# EAGLE schematic Instruction_memory (EAGLE 9.4.2)
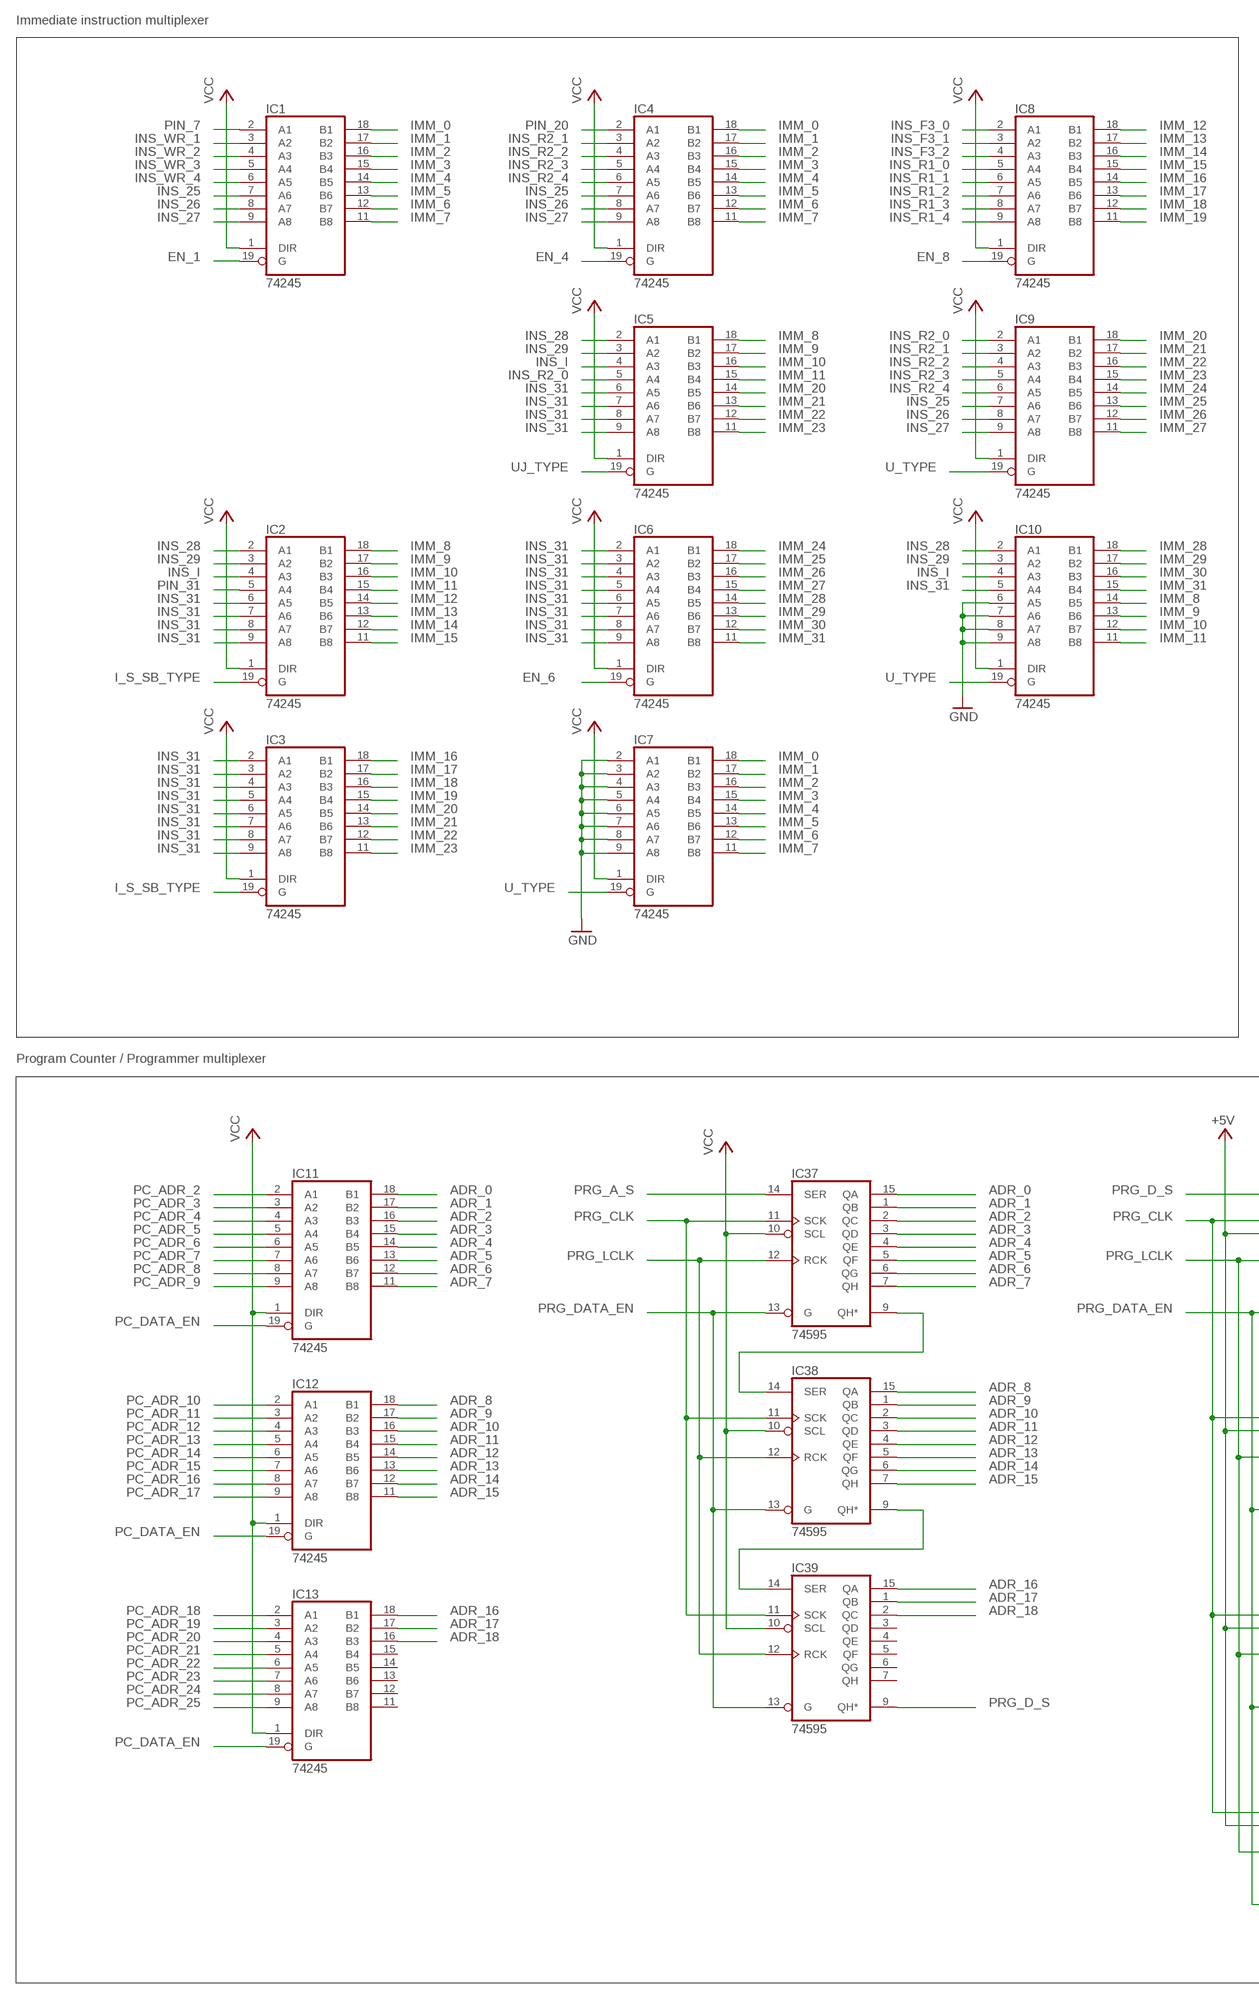
[diagram p0: schematic, sheet 1, part 1 of 2]
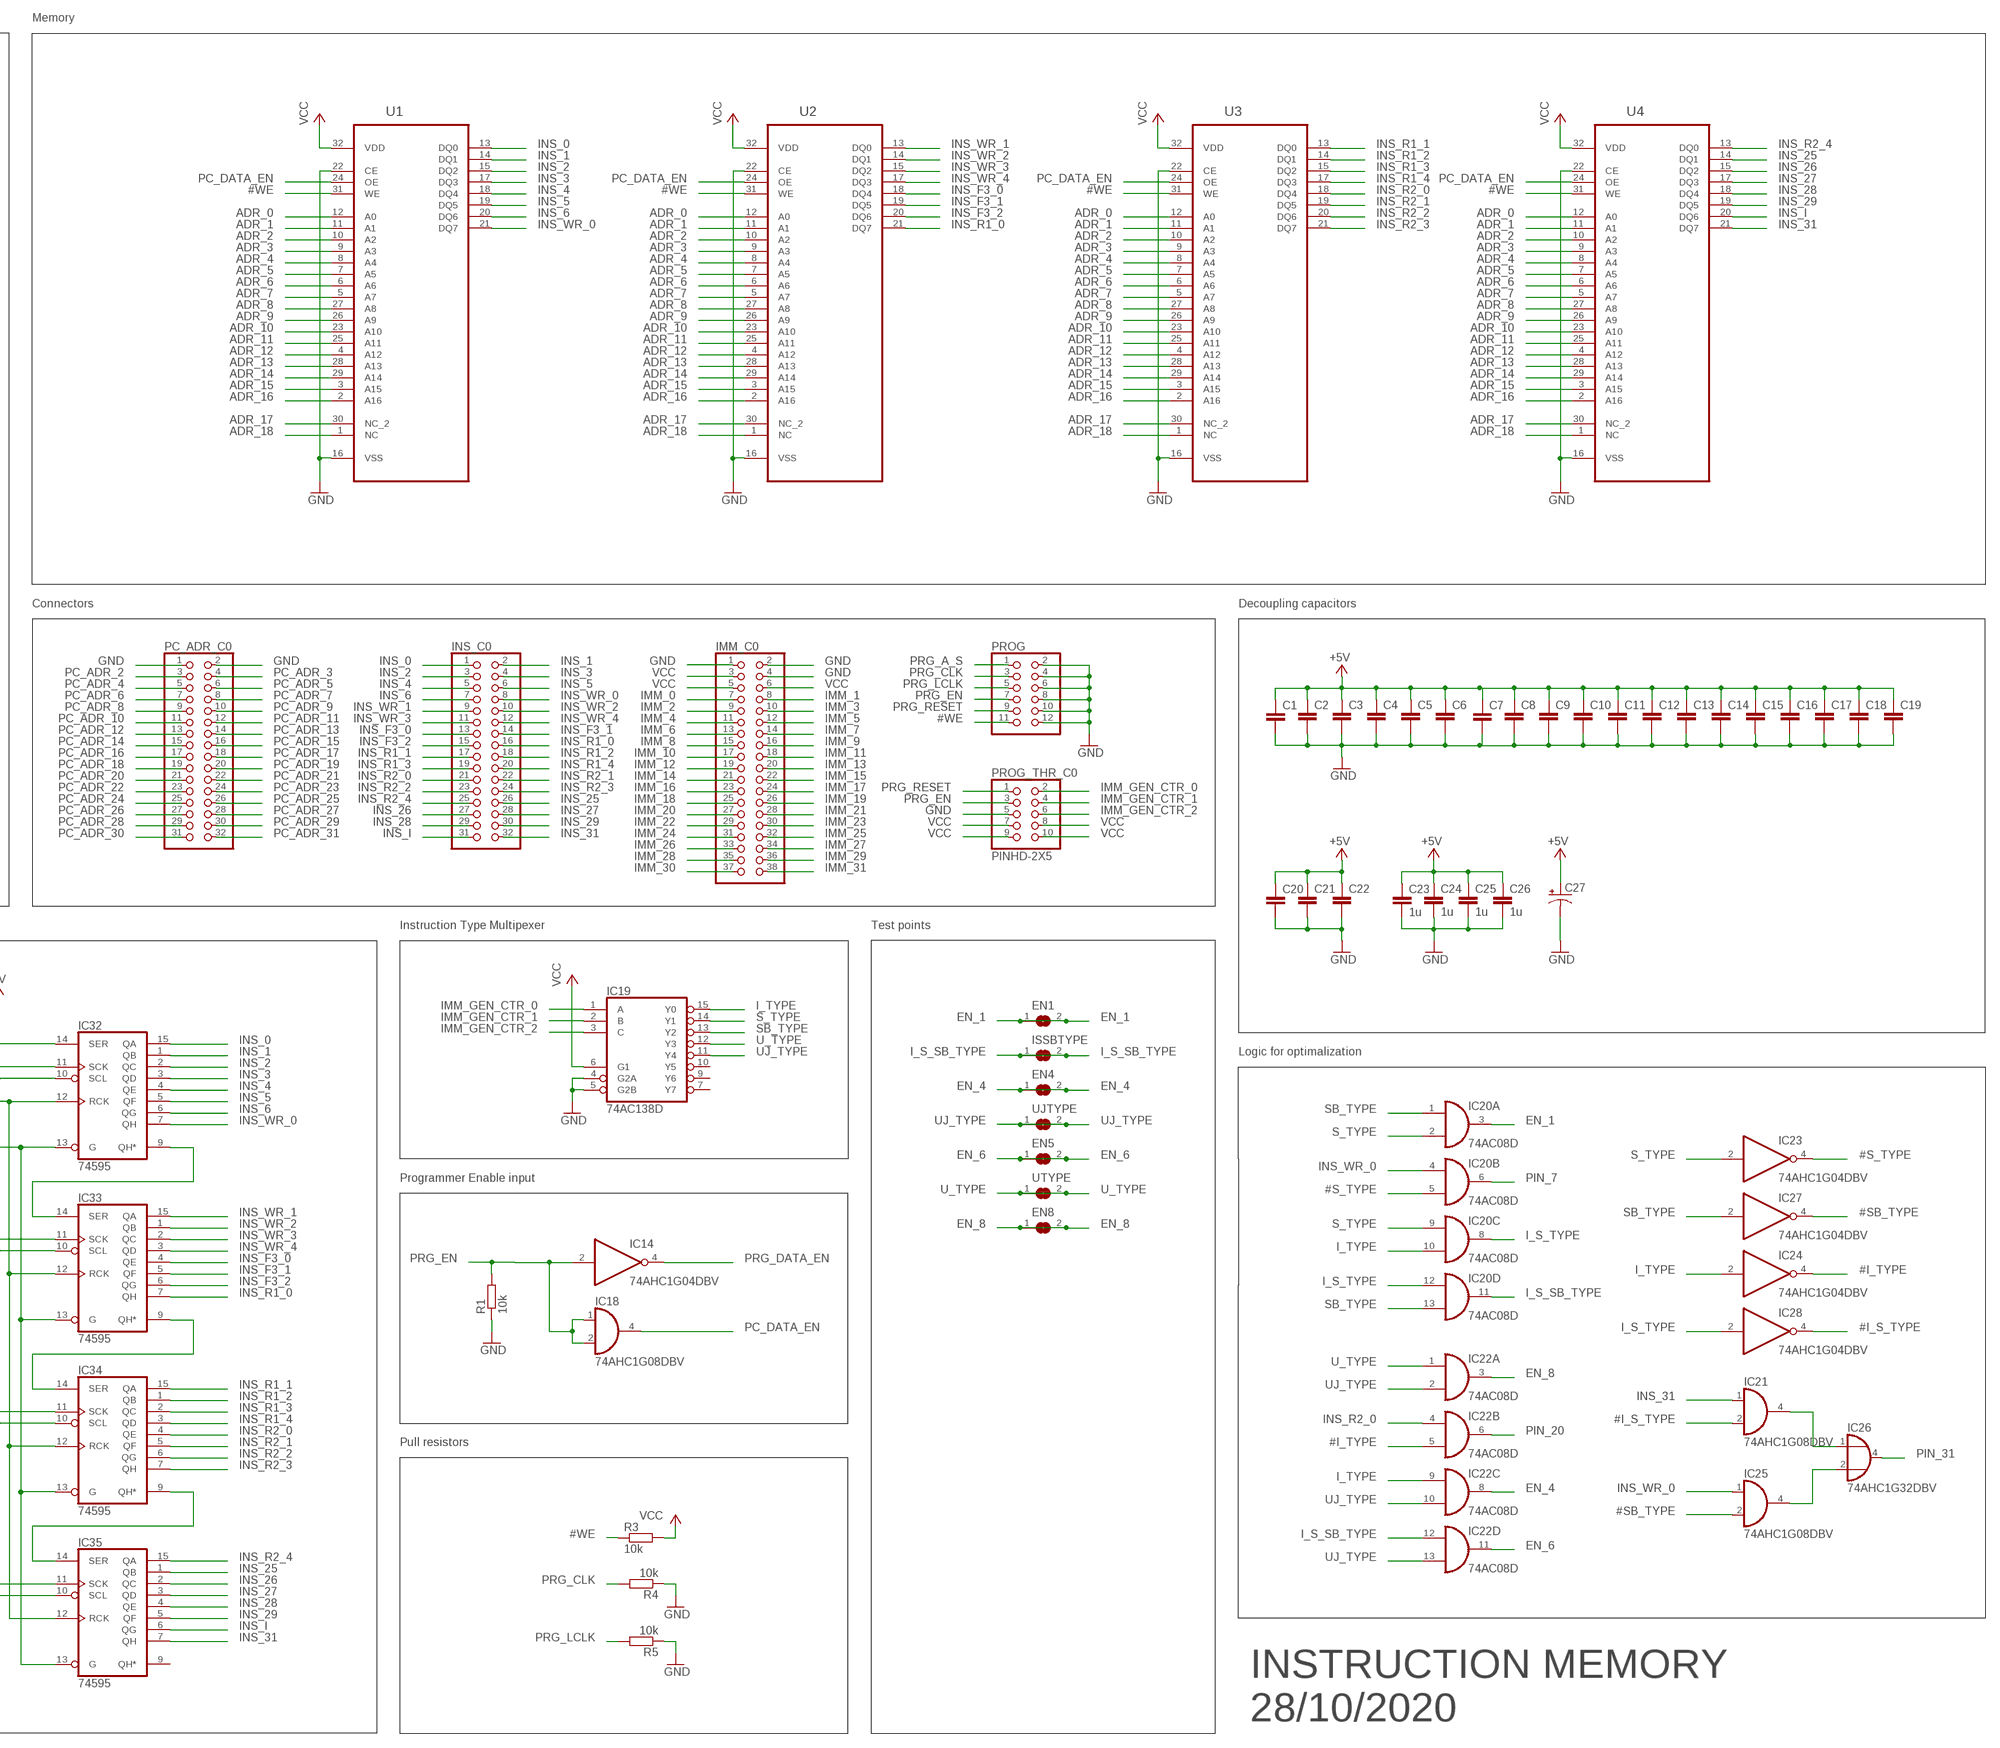
[diagram p1: schematic, sheet 1, part 2 of 2]

## Parts
C1  C-EUC0805  [C0805]
C2  C-EUC0805  [C0805]
C3  C-EUC0805  [C0805]
C4  C-EUC0805  [C0805]
C5  C-EUC0805  [C0805]
C6  C-EUC0805  [C0805]
C7  C-EUC0805  [C0805]
C8  C-EUC0805  [C0805]
C9  C-EUC0805  [C0805]
C10  C-EUC0805  [C0805]
C11  C-EUC0805  [C0805]
C12  C-EUC0805  [C0805]
C13  C-EUC0805  [C0805]
C14  C-EUC0805  [C0805]
C15  C-EUC0805  [C0805]
C16  C-EUC0805  [C0805]
C17  C-EUC0805  [C0805]
C18  C-EUC0805  [C0805]
C19  C-EUC0805  [C0805]
C20  C-EUC0805  [C0805]
C21  C-EUC0805  [C0805]
C22  C-EUC0805  [C0805]
C23  1u  C-EUC0805  [C0805]
C24  1u  C-EUC0805  [C0805]
C25  1u  C-EUC0805  [C0805]
C26  1u  C-EUC0805  [C0805]
C27  CAPACITOR-P153CLV-1010  [153CLV-1010]
EN1  SJ  [SJ]
EN4  SJ  [SJ]
EN5  SJ  [SJ]
EN8  SJ  [SJ]
IC1  74245  [TSSOP20]
IC2  74245  [TSSOP20]
IC3  74245  [TSSOP20]
IC4  74245  [TSSOP20]
IC5  74245  [TSSOP20]
IC6  74245  [TSSOP20]
IC7  74245  [TSSOP20]
IC8  74245  [TSSOP20]
IC9  74245  [TSSOP20]
IC10  74245  [TSSOP20]
IC11  74245  [TSSOP20]
IC12  74245  [TSSOP20]
IC13  74245  [TSSOP20]
IC14  74AHC1G04DBV  [SOT23-5]
IC18  74AHC1G08DBV  [SOT23-5]
IC19  74AC138D  [SO16]
IC20  74AC08D  [SO14]
IC21  74AHC1G08DBV  [SOT23-5]
IC22  74AC08D  [SO14]
IC23  74AHC1G04DBV  [SOT23-5]
IC24  74AHC1G04DBV  [SOT23-5]
IC25  74AHC1G08DBV  [SOT23-5]
IC26  74AHC1G32DBV  [SOT23-5]
IC27  74AHC1G04DBV  [SOT23-5]
IC28  74AHC1G04DBV  [SOT23-5]
IC32  74595  [TSSOP16]
IC33  74595  [TSSOP16]
IC34  74595  [TSSOP16]
IC35  74595  [TSSOP16]
IC37  74595  [TSSOP16]
IC38  74595  [TSSOP16]
IC39  74595  [TSSOP16]
IMM_C0  PINHD-2X19  [2X19]
INS_C0  PINHD-2X16  [2X16]
ISSBTYPE  SJ  [SJ]
PC_ADR_C0  PINHD-2X16  [2X16]
PROG  PINHD-2X6  [2X06]
PROG_THR_C0  PINHD-2X5  [2X05]
R1  10k  R-EU_R0805  [R0805]
R3  10k  R-EU_R0805  [R0805]
R4  10k  R-EU_R0805  [R0805]
R5  10k  R-EU_R0805  [R0805]
U1  SST39SF010A-70-4I-NHEPLCC32  [S32]
U2  SST39SF010A-70-4I-NHEPLCC32  [S32]
U3  SST39SF010A-70-4I-NHEPLCC32  [S32]
U4  SST39SF010A-70-4I-NHEPLCC32  [S32]
UJTYPE  SJ  [SJ]
UTYPE  SJ  [SJ]

## Nets
#I_S_TYPE: IC21.2(I1) IC28.4(O)
#I_TYPE: IC22.5(B:I1) IC24.4(O)
#S_TYPE: IC20.5(B:I1) IC23.4(O)
#SB_TYPE: IC25.2(I1) IC27.4(O)
#WE: PROG.11 R3.1 U1.31(WE) U2.31(WE) U3.31(WE) U4.31(WE)
ADR_0: IC11.18(B1) IC37.15(QA) U1.12(A0) U2.12(A0) U3.12(A0) U4.12(A0)
ADR_1: IC11.17(B2) IC37.1(QB) U1.11(A1) U2.11(A1) U3.11(A1) U4.11(A1)
ADR_2: IC11.16(B3) IC37.2(QC) U1.10(A2) U2.10(A2) U3.10(A2) U4.10(A2)
ADR_3: IC11.15(B4) IC37.3(QD) U1.9(A3) U2.9(A3) U3.9(A3) U4.9(A3)
ADR_4: IC11.14(B5) IC37.4(QE) U1.8(A4) U2.8(A4) U3.8(A4) U4.8(A4)
ADR_5: IC11.13(B6) IC37.5(QF) U1.7(A5) U2.7(A5) U3.7(A5) U4.7(A5)
ADR_6: IC11.12(B7) IC37.6(QG) U1.6(A6) U2.6(A6) U3.6(A6) U4.6(A6)
ADR_7: IC11.11(B8) IC37.7(QH) U1.5(A7) U2.5(A7) U3.5(A7) U4.5(A7)
ADR_8: IC12.18(B1) IC38.15(QA) U1.27(A8) U2.27(A8) U3.27(A8) U4.27(A8)
ADR_9: IC12.17(B2) IC38.1(QB) U1.26(A9) U2.26(A9) U3.26(A9) U4.26(A9)
ADR_10: IC12.16(B3) IC38.2(QC) U1.23(A10) U2.23(A10) U3.23(A10) U4.23(A10)
ADR_11: IC12.15(B4) IC38.3(QD) U1.25(A11) U2.25(A11) U3.25(A11) U4.25(A11)
ADR_12: IC12.14(B5) IC38.4(QE) U1.4(A12) U2.4(A12) U3.4(A12) U4.4(A12)
ADR_13: IC12.13(B6) IC38.5(QF) U1.28(A13) U2.28(A13) U3.28(A13) U4.28(A13)
ADR_14: IC12.12(B7) IC38.6(QG) U1.29(A14) U2.29(A14) U3.29(A14) U4.29(A14)
ADR_15: IC12.11(B8) IC38.7(QH) U1.3(A15) U2.3(A15) U3.3(A15) U4.3(A15)
ADR_16: IC13.18(B1) IC39.15(QA) U1.2(A16) U2.2(A16) U3.2(A16) U4.2(A16)
ADR_17: IC13.17(B2) IC39.1(QB) U1.30(NC_2) U2.30(NC_2) U3.30(NC_2) U4.30(NC_2)
ADR_18: IC13.16(B3) IC39.2(QC) U1.1(NC) U2.1(NC) U3.1(NC) U4.1(NC)
EN_1: EN1.1 EN1.2 IC1.19(G) IC20.3(A:O)
EN_4: EN4.1 EN4.2 IC4.19(G) IC22.8(C:O)
EN_6: EN5.1 EN5.2 IC6.19(G) IC22.11(D:O)
EN_8: EN8.1 EN8.2 IC8.19(G) IC22.3(A:O)
GND: C1.2 C2.2 C3.2 C4.2 C5.2 C6.2 C7.2 C8.2 C9.2 C10.2 C11.2 C12.2 C13.2 C14.2 C15.2 C16.2 C17.2 C18.2 C19.2 C20.2 C21.2 C22.2 C23.2 C24.2 C25.2 C26.2 C27.- IC7.2(A1) IC7.3(A2) IC7.4(A3) IC7.5(A4) IC7.6(A5) IC7.7(A6) IC7.8(A7) IC7.9(A8) IC10.6(A5) IC10.7(A6) IC10.8(A7) IC10.9(A8) IC19.4(G2A) IC19.5(G2B) IMM_C0.1 IMM_C0.2 IMM_C0.4 PC_ADR_C0.1 PC_ADR_C0.2 PROG.2 PROG.4 PROG.6 PROG.8 PROG.10 PROG.12 PROG_THR_C0.5 R1.1 R4.1 R5.1 U1.16(VSS) U1.22(CE) U2.16(VSS) U2.22(CE) U3.16(VSS) U3.22(CE) U4.16(VSS) U4.22(CE)
I_S_SB_TYPE: IC2.19(G) IC3.19(G) IC20.11(D:O) IC22.12(D:I0) ISSBTYPE.1 ISSBTYPE.2
I_S_TYPE: IC20.8(C:O) IC20.12(D:I0) IC28.2(I)
I_TYPE: IC19.15(Y0) IC20.10(C:I1) IC22.9(C:I0) IC24.2(I)
IMM_0: IC1.18(B1) IC4.18(B1) IC7.18(B1) IMM_C0.7
IMM_1: IC1.17(B2) IC4.17(B2) IC7.17(B2) IMM_C0.8
IMM_2: IC1.16(B3) IC4.16(B3) IC7.16(B3) IMM_C0.9
IMM_3: IC1.15(B4) IC4.15(B4) IC7.15(B4) IMM_C0.10
IMM_4: IC1.14(B5) IC4.14(B5) IC7.14(B5) IMM_C0.11
IMM_5: IC1.13(B6) IC4.13(B6) IC7.13(B6) IMM_C0.12
IMM_6: IC1.12(B7) IC4.12(B7) IC7.12(B7) IMM_C0.13
IMM_7: IC1.11(B8) IC4.11(B8) IC7.11(B8) IMM_C0.14
IMM_8: IC2.18(B1) IC5.18(B1) IC10.14(B5) IMM_C0.15
IMM_9: IC2.17(B2) IC5.17(B2) IC10.13(B6) IMM_C0.16
IMM_10: IC2.16(B3) IC5.16(B3) IC10.12(B7) IMM_C0.17
IMM_11: IC2.15(B4) IC5.15(B4) IC10.11(B8) IMM_C0.18
IMM_12: IC2.14(B5) IC8.18(B1) IMM_C0.19
IMM_13: IC2.13(B6) IC8.17(B2) IMM_C0.20
IMM_14: IC2.12(B7) IC8.16(B3) IMM_C0.21
IMM_15: IC2.11(B8) IC8.15(B4) IMM_C0.22
IMM_16: IC3.18(B1) IC8.14(B5) IMM_C0.23
IMM_17: IC3.17(B2) IC8.13(B6) IMM_C0.24
IMM_18: IC3.16(B3) IC8.12(B7) IMM_C0.25
IMM_19: IC3.15(B4) IC8.11(B8) IMM_C0.26
IMM_20: IC3.14(B5) IC5.14(B5) IC9.18(B1) IMM_C0.27
IMM_21: IC3.13(B6) IC5.13(B6) IC9.17(B2) IMM_C0.28
IMM_22: IC3.12(B7) IC5.12(B7) IC9.16(B3) IMM_C0.29
IMM_23: IC3.11(B8) IC5.11(B8) IC9.15(B4) IMM_C0.30
IMM_24: IC6.18(B1) IC9.14(B5) IMM_C0.31
IMM_25: IC6.17(B2) IC9.13(B6) IMM_C0.32
IMM_26: IC6.16(B3) IC9.12(B7) IMM_C0.33
IMM_27: IC6.15(B4) IC9.11(B8) IMM_C0.34
IMM_28: IC6.14(B5) IC10.18(B1) IMM_C0.35
IMM_29: IC6.13(B6) IC10.17(B2) IMM_C0.36
IMM_30: IC6.12(B7) IC10.16(B3) IMM_C0.37
IMM_31: IC6.11(B8) IC10.15(B4) IMM_C0.38
IMM_GEN_CTR_0: IC19.1(A) PROG_THR_C0.2
IMM_GEN_CTR_1: IC19.2(B) PROG_THR_C0.4
IMM_GEN_CTR_2: IC19.3(C) PROG_THR_C0.6
INS_0: IC32.15(QA) INS_C0.1 U1.13(DQ0)
INS_1: IC32.1(QB) INS_C0.2 U1.14(DQ1)
INS_2: IC32.2(QC) INS_C0.3 U1.15(DQ2)
INS_3: IC32.3(QD) INS_C0.4 U1.17(DQ3)
INS_4: IC32.4(QE) INS_C0.5 U1.18(DQ4)
INS_5: IC32.5(QF) INS_C0.6 U1.19(DQ5)
INS_6: IC32.6(QG) INS_C0.7 U1.20(DQ6)
INS_25: IC1.7(A6) IC4.7(A6) IC9.7(A6) IC35.1(QB) INS_C0.26 U4.14(DQ1)
INS_26: IC1.8(A7) IC4.8(A7) IC9.8(A7) IC35.2(QC) INS_C0.27 U4.15(DQ2)
INS_27: IC1.9(A8) IC4.9(A8) IC9.9(A8) IC35.3(QD) INS_C0.28 U4.17(DQ3)
INS_28: IC2.2(A1) IC5.2(A1) IC10.2(A1) IC35.4(QE) INS_C0.29 U4.18(DQ4)
INS_29: IC2.3(A2) IC5.3(A2) IC10.3(A2) IC35.5(QF) INS_C0.30 U4.19(DQ5)
INS_31: IC2.6(A5) IC2.7(A6) IC2.8(A7) IC2.9(A8) IC3.2(A1) IC3.3(A2) IC3.4(A3) IC3.5(A4) IC3.6(A5) IC3.7(A6) IC3.8(A7) IC3.9(A8) IC5.6(A5) IC5.7(A6) IC5.8(A7) IC5.9(A8) IC6.2(A1) IC6.3(A2) IC6.4(A3) IC6.5(A4) IC6.6(A5) IC6.7(A6) IC6.8(A7) IC6.9(A8) IC10.5(A4) IC21.1(I0) IC35.7(QH) INS_C0.32 U4.21(DQ7)
INS_F3_0: IC8.2(A1) IC33.4(QE) INS_C0.13 U2.18(DQ4)
INS_F3_1: IC8.3(A2) IC33.5(QF) INS_C0.14 U2.19(DQ5)
INS_F3_2: IC8.4(A3) IC33.6(QG) INS_C0.15 U2.20(DQ6)
INS_I: IC2.4(A3) IC5.4(A3) IC10.4(A3) IC35.6(QG) INS_C0.31 U4.20(DQ6)
INS_R1_0: IC8.5(A4) IC33.7(QH) INS_C0.16 U2.21(DQ7)
INS_R1_1: IC8.6(A5) IC34.15(QA) INS_C0.17 U3.13(DQ0)
INS_R1_2: IC8.7(A6) IC34.1(QB) INS_C0.18 U3.14(DQ1)
INS_R1_3: IC8.8(A7) IC34.2(QC) INS_C0.19 U3.15(DQ2)
INS_R1_4: IC8.9(A8) IC34.3(QD) INS_C0.20 U3.17(DQ3)
INS_R2_0: IC5.5(A4) IC9.2(A1) IC22.4(B:I0) IC34.4(QE) INS_C0.21 U3.18(DQ4)
INS_R2_1: IC4.3(A2) IC9.3(A2) IC34.5(QF) INS_C0.22 U3.19(DQ5)
INS_R2_2: IC4.4(A3) IC9.4(A3) IC34.6(QG) INS_C0.23 U3.20(DQ6)
INS_R2_3: IC4.5(A4) IC9.5(A4) IC34.7(QH) INS_C0.24 U3.21(DQ7)
INS_R2_4: IC4.6(A5) IC9.6(A5) IC35.15(QA) INS_C0.25 U4.13(DQ0)
INS_WR_0: IC20.4(B:I0) IC25.1(I0) IC32.7(QH) INS_C0.8 U1.21(DQ7)
INS_WR_1: IC1.3(A2) IC33.15(QA) INS_C0.9 U2.13(DQ0)
INS_WR_2: IC1.4(A3) IC33.1(QB) INS_C0.10 U2.14(DQ1)
INS_WR_3: IC1.5(A4) IC33.2(QC) INS_C0.11 U2.15(DQ2)
INS_WR_4: IC1.6(A5) IC33.3(QD) INS_C0.12 U2.17(DQ3)
N$2: IC21.4(O) IC26.1(I0)
N$3: IC25.4(O) IC26.2(I1)
N$5: IC32.9(QH*) IC33.14(SER)
N$6: IC33.9(QH*) IC34.14(SER)
N$7: IC34.9(QH*) IC35.14(SER)
N$9: IC37.9(QH*) IC38.14(SER)
N$10: IC38.9(QH*) IC39.14(SER)
PC_ADR_2: IC11.2(A1) PC_ADR_C0.3
PC_ADR_3: IC11.3(A2) PC_ADR_C0.4
PC_ADR_4: IC11.4(A3) PC_ADR_C0.5
PC_ADR_5: IC11.5(A4) PC_ADR_C0.6
PC_ADR_6: IC11.6(A5) PC_ADR_C0.7
PC_ADR_7: IC11.7(A6) PC_ADR_C0.8
PC_ADR_8: IC11.8(A7) PC_ADR_C0.9
PC_ADR_9: IC11.9(A8) PC_ADR_C0.10
PC_ADR_10: IC12.2(A1) PC_ADR_C0.11
PC_ADR_11: IC12.3(A2) PC_ADR_C0.12
PC_ADR_12: IC12.4(A3) PC_ADR_C0.13
PC_ADR_13: IC12.5(A4) PC_ADR_C0.14
PC_ADR_14: IC12.6(A5) PC_ADR_C0.15
PC_ADR_15: IC12.7(A6) PC_ADR_C0.16
PC_ADR_16: IC12.8(A7) PC_ADR_C0.17
PC_ADR_17: IC12.9(A8) PC_ADR_C0.18
PC_ADR_18: IC13.2(A1) PC_ADR_C0.19
PC_ADR_19: IC13.3(A2) PC_ADR_C0.20
PC_ADR_20: IC13.4(A3) PC_ADR_C0.21
PC_ADR_21: IC13.5(A4) PC_ADR_C0.22
PC_ADR_22: IC13.6(A5) PC_ADR_C0.23
PC_ADR_23: IC13.7(A6) PC_ADR_C0.24
PC_ADR_24: IC13.8(A7) PC_ADR_C0.25
PC_ADR_25: IC13.9(A8) PC_ADR_C0.26
PC_ADR_26: PC_ADR_C0.27
PC_ADR_27: PC_ADR_C0.28
PC_ADR_28: PC_ADR_C0.29
PC_ADR_29: PC_ADR_C0.30
PC_ADR_30: PC_ADR_C0.31
PC_ADR_31: PC_ADR_C0.32
PC_DATA_EN: IC11.19(G) IC12.19(G) IC13.19(G) IC18.4(O) U1.24(OE) U2.24(OE) U3.24(OE) U4.24(OE)
PIN_7: IC1.2(A1) IC20.6(B:O)
PIN_20: IC4.2(A1) IC22.6(B:O)
PIN_31: IC2.5(A4) IC26.4(O)
PRG_A_S: IC37.14(SER) PROG.1
PRG_CLK: IC32.11(SCK) IC33.11(SCK) IC34.11(SCK) IC35.11(SCK) IC37.11(SCK) IC38.11(SCK) IC39.11(SCK) PROG.3 R4.2
PRG_D_S: IC32.14(SER) IC39.9(QH*)
PRG_DATA_EN: IC14.4(O) IC32.13(G) IC33.13(G) IC34.13(G) IC35.13(G) IC37.13(G) IC38.13(G) IC39.13(G)
PRG_EN: IC14.2(I) IC18.1(I0) IC18.2(I1) PROG.7 PROG_THR_C0.3 R1.2
PRG_LCLK: IC32.12(RCK) IC33.12(RCK) IC34.12(RCK) IC35.12(RCK) IC37.12(RCK) IC38.12(RCK) IC39.12(RCK) PROG.5 R5.2
PRG_RESET: PROG.9 PROG_THR_C0.1
S_TYPE: IC19.14(Y1) IC20.2(A:I1) IC20.9(C:I0) IC23.2(I)
SB_TYPE: IC19.13(Y2) IC20.1(A:I0) IC20.13(D:I1) IC27.2(I)
U_TYPE: IC7.19(G) IC9.19(G) IC10.19(G) IC19.12(Y3) IC22.1(A:I0) UTYPE.1 UTYPE.2
UJ_TYPE: IC5.19(G) IC19.11(Y4) IC22.2(A:I1) IC22.10(C:I1) IC22.13(D:I1) UJTYPE.1 UJTYPE.2
VCC: C1.1 C2.1 C3.1 C4.1 C5.1 C6.1 C7.1 C8.1 C9.1 C10.1 C11.1 C12.1 C13.1 C14.1 C15.1 C16.1 C17.1 C18.1 C19.1 C20.1 C21.1 C22.1 C23.1 C24.1 C25.1 C26.1 C27.+ IC1.1(DIR) IC2.1(DIR) IC3.1(DIR) IC4.1(DIR) IC5.1(DIR) IC6.1(DIR) IC7.1(DIR) IC8.1(DIR) IC9.1(DIR) IC10.1(DIR) IC11.1(DIR) IC12.1(DIR) IC13.1(DIR) IC19.6(G1) IC32.10(SCL) IC33.10(SCL) IC34.10(SCL) IC35.10(SCL) IC37.10(SCL) IC38.10(SCL) IC39.10(SCL) IMM_C0.3 IMM_C0.5 IMM_C0.6 PROG_THR_C0.7 PROG_THR_C0.8 PROG_THR_C0.9 PROG_THR_C0.10 R3.2 U1.32(VDD) U2.32(VDD) U3.32(VDD) U4.32(VDD) ; supply symbol labelled +5V
Unconnected: IC13.11(B8) IC13.12(B7) IC13.13(B6) IC13.14(B5) IC13.15(B4) IC19.7(Y7) IC19.9(Y6) IC19.10(Y5) IC35.9(QH*) IC39.3(QD) IC39.4(QE) IC39.5(QF) IC39.6(QG) IC39.7(QH)

## Notes on the sheet
- Immediate instruction multiplexer | Memory
- Connectors | Decoupling capacitors
- Program Counter / Programmer multiplexer | Instruction Type Multipexer | Test points
- Logic for optimalization
- Programmer Enable input
- Pull resistors
- INSTRUCTION MEMORY
  28/10/2020

## Power pins joined to a net without a drawn wire
GND: IC1.10(GND) IC2.10(GND) IC3.10(GND) IC4.10(GND) IC5.10(GND) IC6.10(GND) IC7.10(GND) IC8.10(GND) IC9.10(GND) IC10.10(GND) IC11.10(GND) IC12.10(GND) IC13.10(GND) IC14.3(GND) IC18.3(GND) IC19.8(GND) IC20.7(P:GND) IC21.3(GND) IC22.7(P:GND) IC23.3(GND) IC24.3(GND) IC25.3(GND) IC26.3(GND) IC27.3(GND) IC28.3(GND) IC32.8(GND) IC33.8(GND) IC34.8(GND) IC35.8(GND) IC37.8(GND) IC38.8(GND) IC39.8(GND)
VCC: IC1.20(VCC) IC2.20(VCC) IC3.20(VCC) IC4.20(VCC) IC5.20(VCC) IC6.20(VCC) IC7.20(VCC) IC8.20(VCC) IC9.20(VCC) IC10.20(VCC) IC11.20(VCC) IC12.20(VCC) IC13.20(VCC) IC14.5(VCC) IC18.5(VCC) IC19.16(VCC) IC20.14(P:VCC) IC21.5(VCC) IC22.14(P:VCC) IC23.5(VCC) IC24.5(VCC) IC25.5(VCC) IC26.5(VCC) IC27.5(VCC) IC28.5(VCC) IC32.16(VCC) IC33.16(VCC) IC34.16(VCC) IC35.16(VCC) IC37.16(VCC) IC38.16(VCC) IC39.16(VCC)

## Library data of the parts
C1-C26 = rcl:C-EU: CAPACITOR, European symbol; SPICEPREFIX: C
C27 = BeagleBone_Blue_R3:CAPACITOR-P: POLARIZED CAPACITOR, American symbol
EN1 EN4 EN5 EN8 ISSBTYPE UJTYPE UTYPE = jumper:SJ: SMD solder JUMPER
IC1-IC13 = AAA__74xx-eu:74*245: Octal BUS TRANSCEIVER, 3-state
IC14 IC23 IC24 IC27 IC28 = 74xx-little-us:74*1G04: INVERTER Gate
IC18 IC21 IC25 = 74xx-little-de:74*1G08: 2-input AND gate
IC19 = AAA__74xx-eu:74*138: 3-line to 8-line DECODER/DEMULTIPLEXER
IC20 IC22 = AAA__74xx-eu:74*08: Quad 2-input AND gate
IC26 = 74xx-little-de:74*1G32: 2-input OR gate
IC32-IC35 IC37-IC39 = AAA__74xx-eu:74*595: 8-bit SHIFT REGISTER, output latch
IMM_C0 = pinhead:PINHD-2X19: PIN HEADER
INS_C0 PC_ADR_C0 = pinhead:PINHD-2X16: PIN HEADER
PROG = pinhead:PINHD-2X6: PIN HEADER
PROG_THR_C0 = Connector:PINHD-2X5: PIN HEADER; CATEGORY: CONNECTOR; SUB-CATEGORY: PIN-HEADER
R1 R3-R5 = rcl:R-EU_: RESISTOR, European symbol; SPICEPREFIX: R
U1-U4 = SST39SF010A-70-4I-NHE:SST39SF010A-70-4I-NHE: 1MB Flash